# EAGLE design W078 (EAGLE 6.6.0)
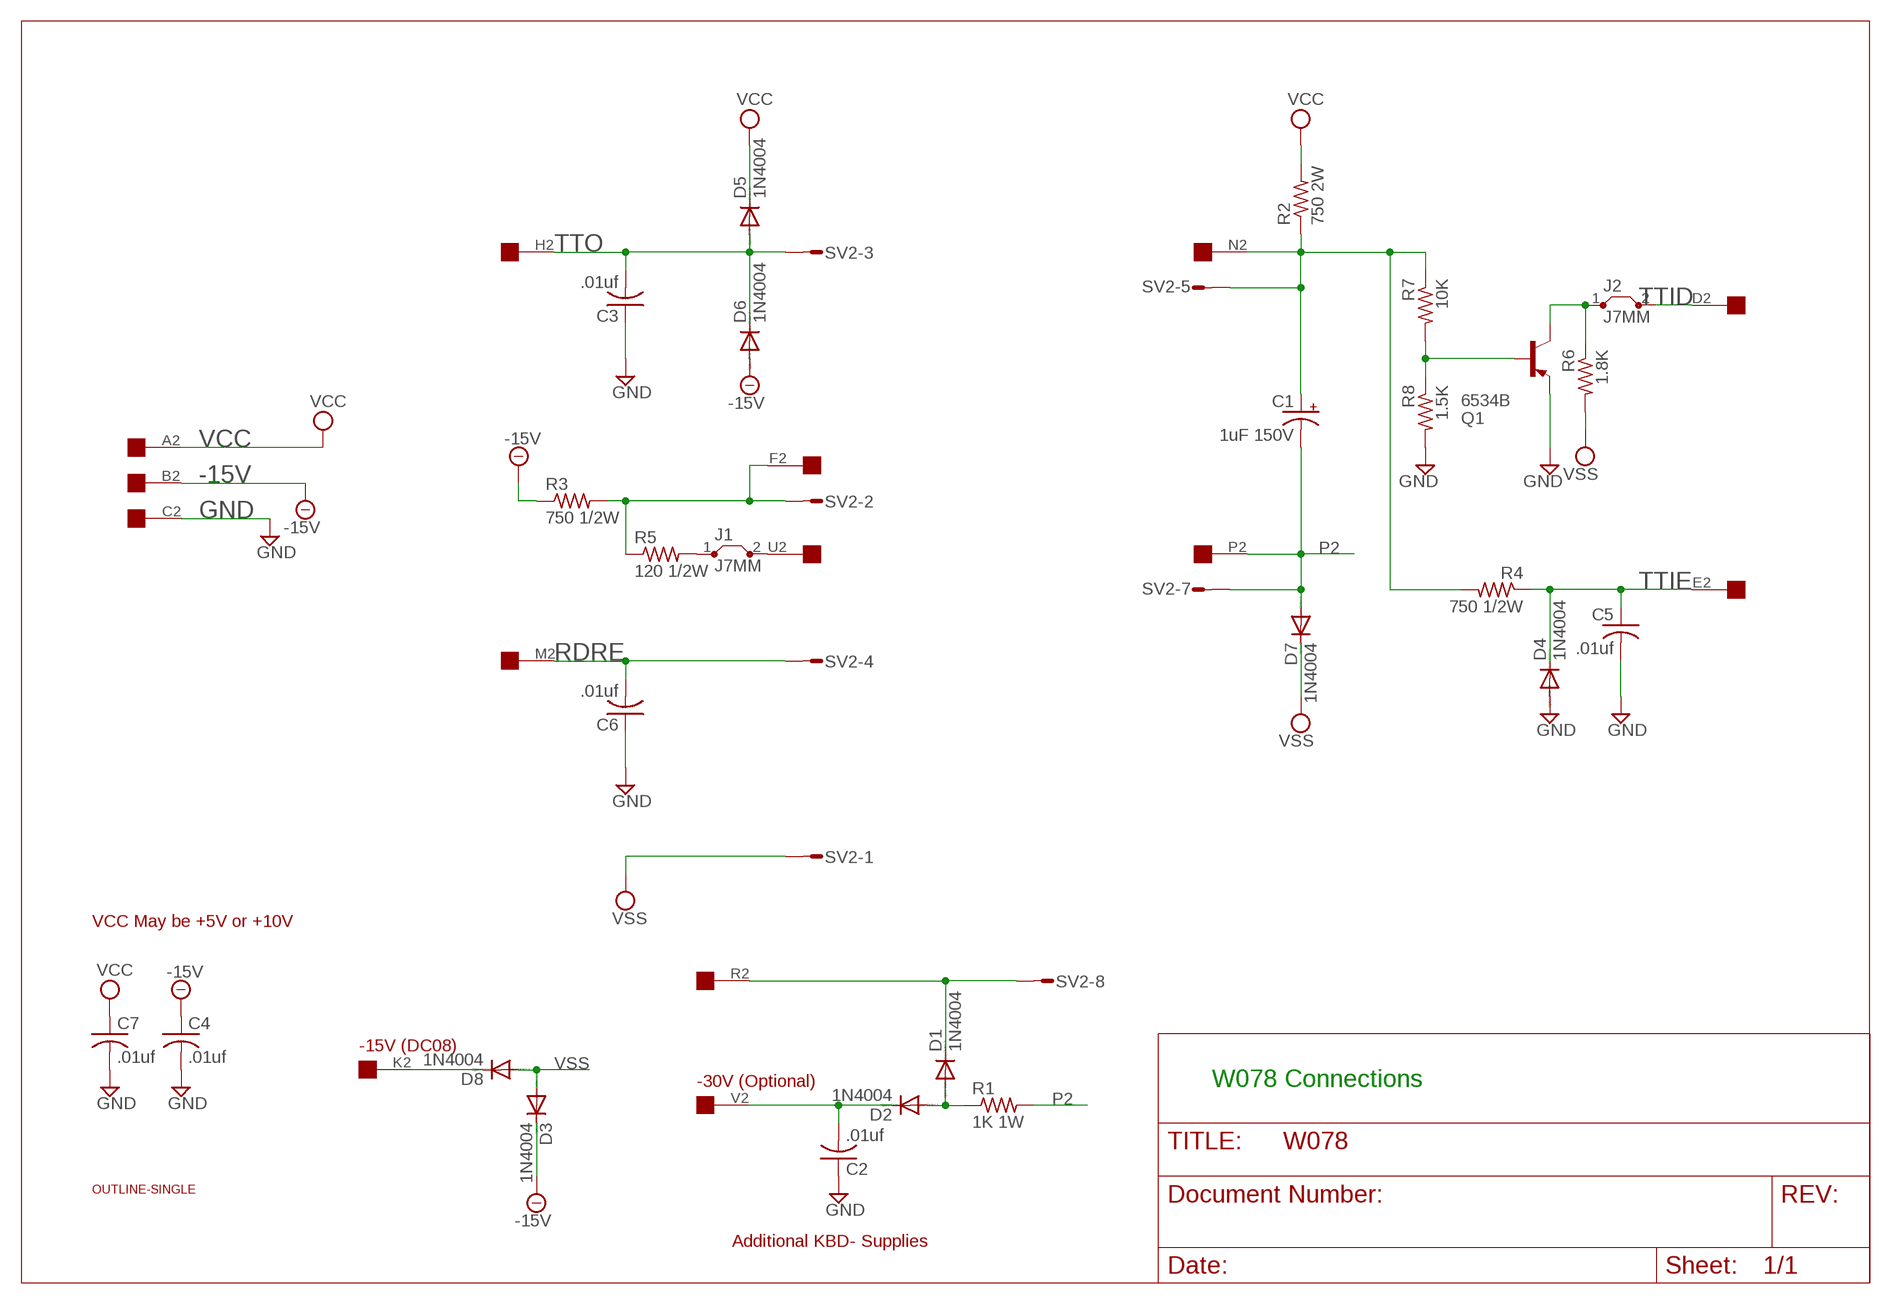
[diagram p0: schematic, sheet 1]

## Parts
C1  1uF 150V  CPOL-USE22-6AXIAL  [E22-6]
C2  .01uf  C-US050-025X075  [C050-025X075]
C3  .01uf  C-US050-025X075  [C050-025X075]
C4  .01uf  C-US050-025X075  [C050-025X075]
C5  .01uf  C-US050-025X075  [C050-025X075]
C6  .01uf  C-US050-025X075  [C050-025X075]
C7  .01uf  C-US050-025X075  [C050-025X075]
D1  1N4004  1N4148DO35-10  [DO35-10]
D2  1N4004  1N4148DO35-10  [DO35-10]
D3  1N4004  1N4148DO35-10  [DO35-10]
D4  1N4004  1N4148DO35-10  [DO35-10]
D5  1N4004  1N4148DO35-10  [DO35-10]
D6  1N4004  1N4148DO35-10  [DO35-10]
D7  1N4004  1N4148DO35-10  [DO35-10]
D8  1N4004  1N4148DO35-10  [DO35-10]
EDGE  EDGE-1  [EDGE-CON1]
J1  J7MM  [07]
J2  J7MM  [07]
Q1  6534B  -PNP-TO92/  [TO92/]
R1  1K 1W  R-US_0411/15  [0411/15]
R2  750 2W  R-US_0411/15  [0411/15]
R3  750 1/2W  R-US_0309/12  [0309/12]
R4  750 1/2W  R-US_0309/12  [0309/12]
R5  120 1/2W  R-US_0309/12  [0309/12]
R6  1.8K  R-US_0207/10  [0207/10]
R7  10K  R-US_0207/10  [0207/10]
R8  1.5K  R-US_0207/10  [0207/10]
SV2  L08P  [L08P]
U$1  OUTLINE-SINGLE  [SINGLE]

## Nets
-15V: C4.1 D3.C D6.A EDGE.B2 R3.1
GND: C2.1 C3.1 C4.2 C5.2 C6.1 C7.2 D4.A EDGE.C2 Q1.1(E) R8.2
N$1: EDGE.F2 R3.2 R5.1 SV2.2
N$2: Q1.2(B) R7.2 R8.1
N$3: D1.C EDGE.R2 SV2.8
N$4: D8.C EDGE.K2
N$5: C2.2 D2.C EDGE.V2
N$6: D1.A D2.A R1.1
N$7: C1.+ EDGE.N2 R2.1 R4.2 R7.1 SV2.5
N$8: J1.1 R5.2
N$9: J2.1 Q1.3(C) R6.1
P2: C1.- D7.A EDGE.P2 R1.2 SV2.7
RDRE: C6.2 EDGE.M2 SV2.4
TTID: EDGE.D2 J2.2
TTIE: C5.1 D4.C EDGE.E2 R4.1
TTO: C3.2 D5.A D6.C EDGE.H2 SV2.3
TTOE: EDGE.U2 J1.2
VCC: C7.1 D5.C EDGE.A2 R2.2
VSS: D3.A D7.C D8.A R6.2 SV2.1
Unconnected: EDGE.J2 EDGE.L2 EDGE.S2 EDGE.T2 SV2.6

## Notes on the sheet
- VCC May be +5V or +10V
- -15V (DC08)
- -30V (Optional) | W078 Connections
- Additional KBD- Supplies

## Library data of the parts
C1 = rcl:CPOL-US: POLARIZED CAPACITOR, American symbol
C2-C7 = rcl:C-US: CAPACITOR, American symbol
D1-D8 = diode:1N4148: DIODE high speed (Philips)
EDGE = dec-con:EDGE-1: Single-Sided DEC Edge Connector -- (side 2)
J1 J2 = jumper:J: Bridge
Q1 = transistor:*-PNP-: PNP Transistror
R1-R8 = rcl:R-US_: RESISTOR, American symbol
SV2 = con-amp-mt:L08P: AMP MT CONNECTOR; OC_FARNELL: unknown; OC_NEWARK: unknown
U$1 = dec-con:OUTLINE-*: Board outlines for DEC boards.

## Board
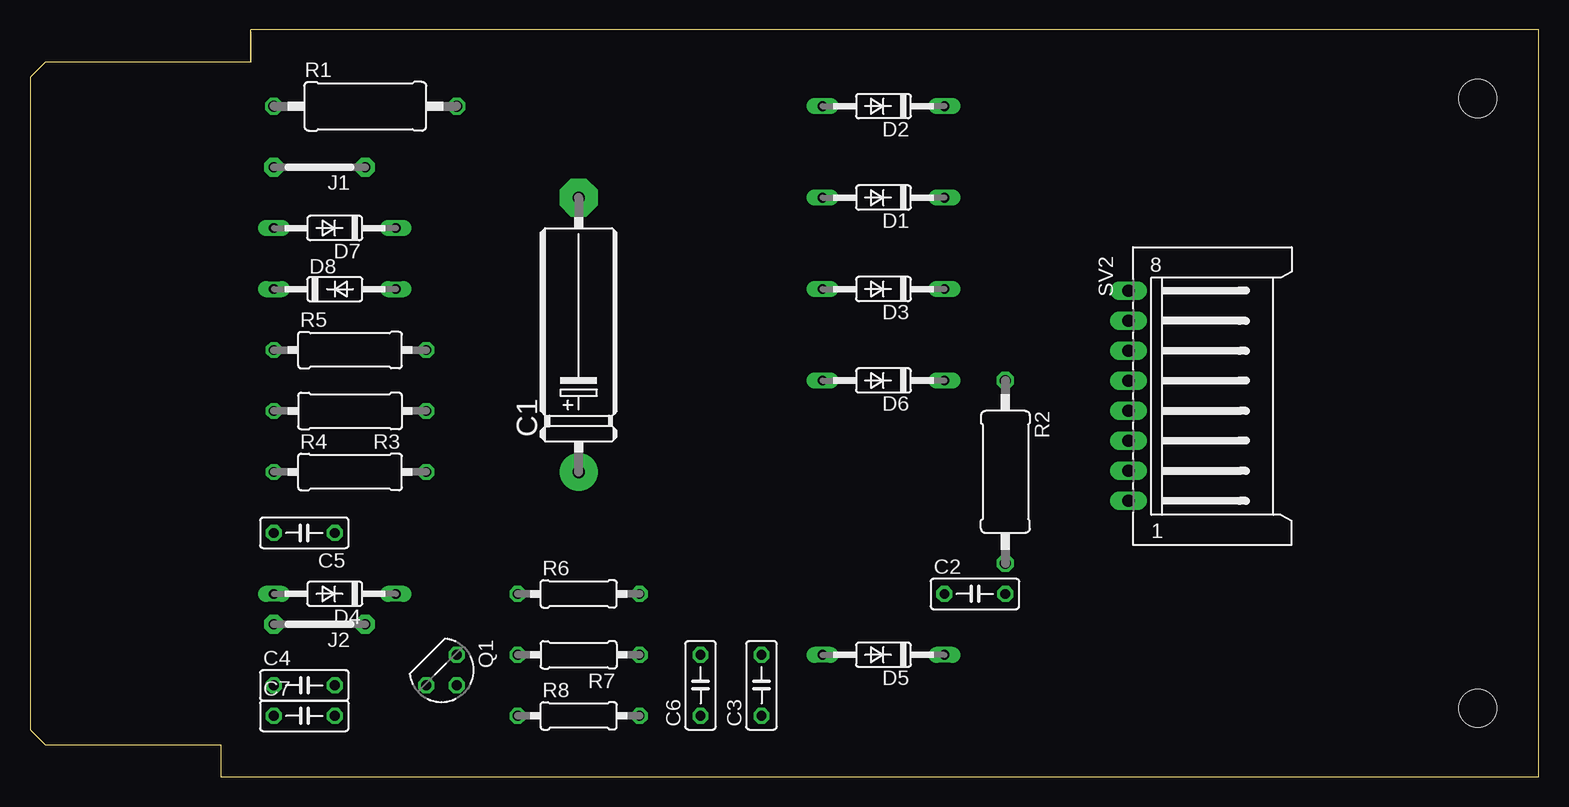
[diagram p1: board, top side]
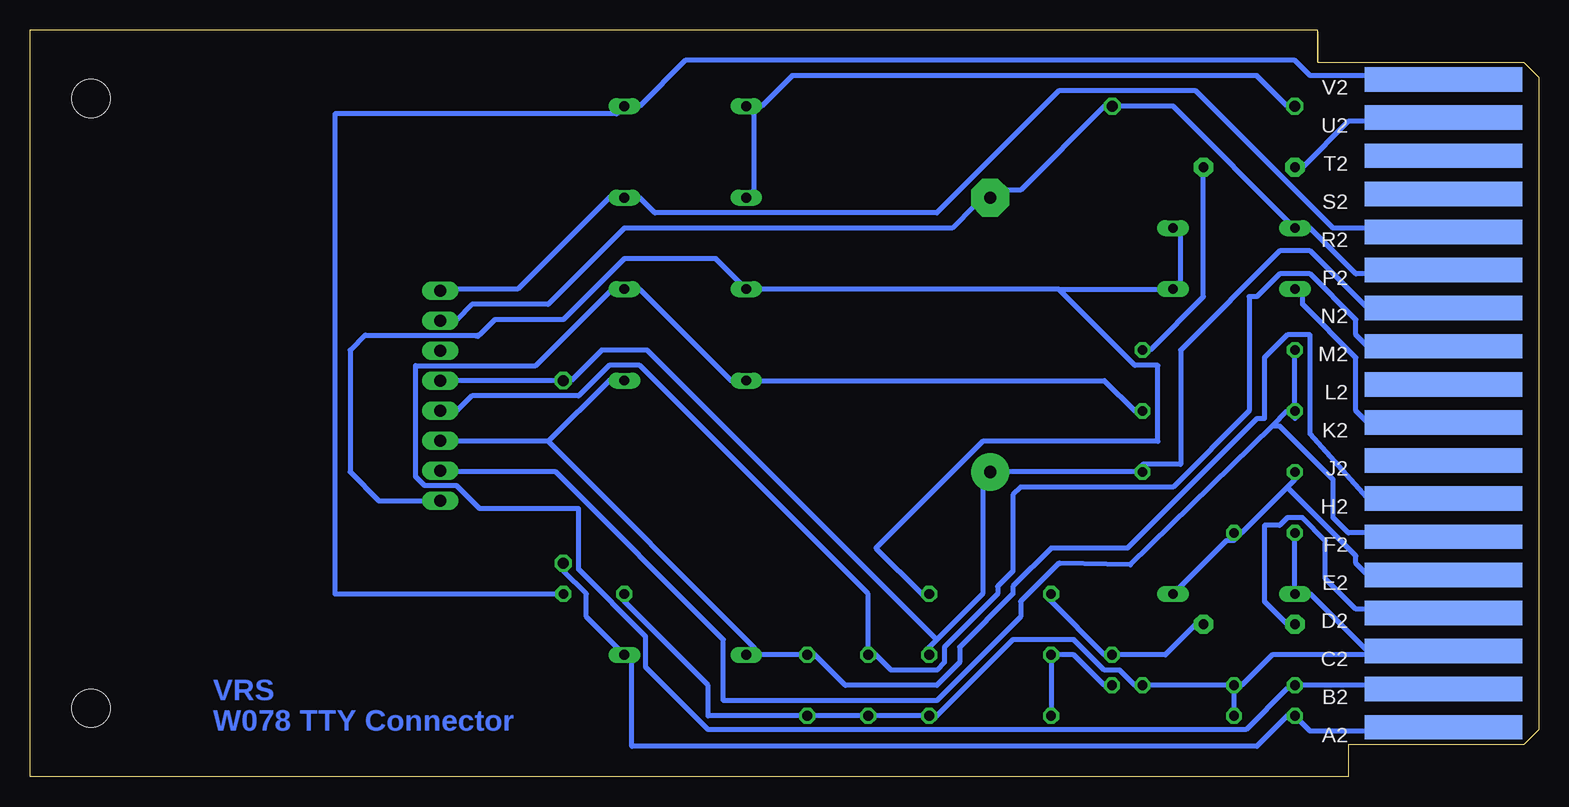
[diagram p2: board, bottom side, seen from below]

Size 125.73 x 62.23 mm. Coordinates in mm from the lower left corner, seen from the top.
Copper layers (1+16): Top 0.035mm / dielectric 1.5mm / Bottom 0.035mm
Design rules "16mils": minimum track width 16mil, minimum drill 32mil, track to track 15mil, track to pad 10mil, pad to pad 10mil, via to via 10mil, smd to smd 10mil, copper to edge 13mil, drill to drill 10mil, minimum pad ring 10mil, minimum via ring 8mil, stop-mask expansion 0mil, vias tented up to drill 0mil, thermal gap 10mil

### Footprints (pad centres in the part's own frame; a part is rotated, then mirrored left to right if it is on the bottom)
E22-6 = drill 1.016 pad 3.15: + -11.43,0 | drill 1.016 pad 3.15 octagon: - 11.43,0
C050-025X075 = drill 0.813 octagon: 1 -2.54,0; 2 2.54,0
DO35-10 = drill 0.813 long: A 5.08,0; C -5.08,0
EDGE-CON1 = smd 13.106 x 2.032 bottom: A2 7.938,4.128; B2 7.938,7.303; C2 7.938,10.477; D2 7.938,13.652; E2 7.938,16.828; F2 7.938,20.003; H2 7.938,23.177; J2 7.938,26.352; K2 7.938,29.527; L2 7.938,32.703; M2 7.938,35.877; N2 7.938,39.053; P2 7.938,42.227; R2 7.938,45.403; S2 7.938,48.578; T2 7.938,51.752; U2 7.938,54.928; V2 7.938,58.102
07 = drill 0.813 pad 1.6 octagon: 1 -3.81,0; 2 3.81,0
TO92/ = drill 0.813 octagon: 1 1.27,-1.27; 2 1.27,1.27; 3 -1.27,1.27
0411/15 = drill 0.914 octagon: 1 -7.62,0; 2 7.62,0
0309/12 = drill 0.813 octagon: 1 -6.35,0; 2 6.35,0
0207/10 = drill 0.813 octagon: 1 -5.08,0; 2 5.08,0
L08P = drill 1.016 long: 1 8.75,-6.25; 2 6.25,-6.25; 3 3.75,-6.25; 4 1.25,-6.25; 5 -1.25,-6.25; 6 -3.75,-6.25; 7 -6.25,-6.25; 8 -8.75,-6.25
SINGLE = hole 3.175: 120.65,56.515; 120.65,5.715

### Placement (x,y rotation side)
C1  45.72,36.83 90 top
C2  78.74,15.24 0 top
C3  60.96,7.62 90 top
C4  22.86,7.62 0 top
C5  22.86,20.32 180 top
C6  55.88,7.62 90 top
C7  22.86,5.08 0 top
D1  71.12,48.26 180 top
D2  71.12,55.88 180 top
D3  71.12,40.64 180 top
D4  25.4,15.24 180 top
D5  71.12,10.16 180 top
D6  71.12,33.02 180 top
D7  25.4,45.72 180 top
D8  25.4,40.64 0 top
EDGE  0,0 0 top
J1  24.13,50.8 180 top
J2  24.13,12.7 180 top
Q1  34.29,8.89 270 top
R1  27.94,55.88 0 top
R2  81.28,25.4 270 top
R3  26.67,30.48 180 top
R4  26.67,25.4 0 top
R5  26.67,35.56 0 top
R6  45.72,15.24 0 top
R7  45.72,10.16 180 top
R8  45.72,5.08 0 top
SV2  97.79,31.75 270 top
U$1  0,0 0 top

### Tracks (layer width: path | path; a pad name or v marks a point on that pad's centre or on a via)
-15V
  Bottom 0.406: R3.1 33.66,30.48 36.2,33.02 D6.A 67.31,33.02 74.93,40.64 D3.C 77.47,40.39 83.59,34.27 93.6,34.27 93.6,25.02 92.84,24.26 90.17,24.26 88.27,22.35 80.01,22.35 80.01,17.27 74.42,11.68 74.42,9.14 69.22,3.94 24.38,3.94 20.96,7.37 C4.1 13.97,7.62 EDGE.B2
GND
  Bottom 0.406: C4.2 Q1.1 33.66,7.62 34.93,8.89 36.2,8.89 38.74,11.43 43.82,11.43 50.17,5.08 R8.2 C6.1 C3.1 69.22,5.08 69.22,7.62 76.2,14.61 C2.1 | C5.2 D4.A 19.05,15.24 13.97,10.16 | C4.2 C7.2 | 13.34,10.16 13.97,10.16 | 13.97,10.16 22.23,10.16 24.77,7.62 C4.2 | 13.34,10.16 EDGE.C2 12.7,10.16 13.34,10.16
N$1
  Bottom 0.406: R3.2 R5.1 | 22.23,29.21 20.96,30.48 R3.2 | R3.2 20.32,29.84 | EDGE.F2 13.34,20.32 15.88,20.32 17.15,21.59 17.15,24.77 21.59,29.21 22.23,29.21 | 22.23,29.21 34.04,17.65 39.88,17.78 40.01,17.78 43.18,14.61 43.18,13.34 50.17,6.35 67.95,6.35 67.95,11.43 81.92,25.4 90.17,25.4 SV2.2
N$2
  Bottom 0.406: Q1.2 36.2,7.62 38.74,10.16 R7.2 R8.1
N$3
  Bottom 0.406: SV2.8 90.17,40.64 85.09,40.64 77.47,48.26 D1.C 74.93,48.26 73.66,46.99 50.17,46.99 40.01,57.15 28.58,57.15 17.15,45.72 12.7,45.72 EDGE.R2
N$4
  Bottom 0.406: D8.C 19.69,40.01 19.69,39.37 15.24,34.92 15.24,30.48 13.97,29.21 EDGE.K2
N$5
  Bottom 0.406: EDGE.V2 13.97,58.42 19.05,58.42 20.32,59.69 71.12,59.69 74.93,55.88 D2.C 76.84,55.24 100.33,55.24 100.33,15.24 C2.2
N$6
  Bottom 0.406: D1.A 65.41,48.9 65.41,55.24 D2.A 64.77,55.88 62.23,58.42 23.5,58.42 20.96,55.88 R1.1
N$7
  Bottom 0.406: EDGE.N2 13.97,38.73 19.05,43.81 21.59,43.81 29.85,35.56 29.85,26.04 33.02,26.04 R4.2 C1.+ 46.36,24.13 46.36,15.24 50.17,11.43 | 50.17,11.43 50.8,10.79 R7.1 | SV2.5 90.17,33.02 R2.1 80.65,33.02 78.11,35.56 74.3,35.56 50.17,11.43
N$8
  Bottom 0.406: R5.2 32.39,35.56 27.94,40.01 J1.1
N$9
  Bottom 0.406: R6.1 40.64,14.61 36.2,10.16 Q1.3 31.12,10.16 28.58,12.7 J2.1
P2
  Bottom 0.406: EDGE.P2 12.7,41.91 15.24,41.91 19.05,45.72 D7.A 30.48,55.88 R1.2 36.2,55.88 43.18,48.9 44.45,48.9 C1.- 46.99,47.62 48.9,45.72 76.2,45.72 82.55,39.37 88.9,39.37 90.17,38.1 SV2.7
RDRE
  Bottom 0.406: EDGE.M2 13.97,35.56 15.24,36.83 15.24,38.1 19.05,41.91 21.59,41.91 23.5,40.01 24.13,40.01 24.13,30.48 30.48,24.13 43.18,24.13 43.82,23.5 43.82,17.14 45.09,15.88 45.09,15.24 49.53,10.79 49.53,9.53 50.17,8.89 53.98,8.89 55.25,10.16 C6.2 55.88,15.24 74.93,34.29 77.47,34.29 80.01,31.75 88.9,31.75 90.17,30.48 SV2.4
TTID
  Bottom 0.406: J2.2 20.96,12.7 22.86,14.61 22.86,20.95 21.59,20.95 20.96,21.59 19.69,21.59 17.78,19.68 17.78,16.51 15.24,13.97 13.97,13.97 EDGE.D2
TTIE
  Bottom 0.406: D4.C 26.04,19.68 25.4,19.68 C5.1 24.77,20.32 20.96,24.13 | 20.96,24.13 20.32,24.77 R4.1 | 20.96,24.13 15.24,18.41 15.24,17.78 13.97,16.51 EDGE.E2
TTO
  Bottom 0.406: 82.55,27.94 77.47,33.02 D6.C | 82.55,27.94 90.17,27.94 SV2.3 | EDGE.H2 13.34,22.86 13.97,22.86 19.05,28.57 19.05,36.83 20.96,36.83 22.86,34.92 22.86,29.84 23.5,29.84 34.29,19.05 40.64,19.05 43.82,15.88 43.82,15.24 48.26,10.79 48.26,9.53 50.17,7.62 57.79,7.62 60.33,10.16 C3.2 D5.A 65.41,10.79 82.55,27.94
TTOE
  Bottom 0.406: J1.2 19.69,50.8 15.88,54.61 13.34,54.61 EDGE.U2
VCC
  Bottom 0.406: EDGE.A2 13.97,3.81 19.05,3.81 C7.1 20.96,5.08 23.5,2.54 75.57,2.54 75.57,9.53 D5.C 79.38,13.34 79.38,15.24 81.28,17.14 R2.2
VSS
  Bottom 0.406: D7.C 29.85,45.09 29.85,41.27 D8.A 40.01,40.64 | 40.01,40.64 D3.A 68.58,43.18 76.2,43.18 81.28,38.1 87,38.1 88.27,36.83 88.57,36.75 | R6.2 51.44,15.24 55.25,19.05 46.36,27.94 31.75,27.94 31.75,34.29 33.66,34.29 40.01,40.64 | SV2.1 96.66,23 99.06,25.4 99.06,35.56 97.79,36.83 97.61,36.75 88.57,36.75 | 88.57,36.75 88.39,36.7

### Text on the board
Bottom: VRS | W078 TTY Connector